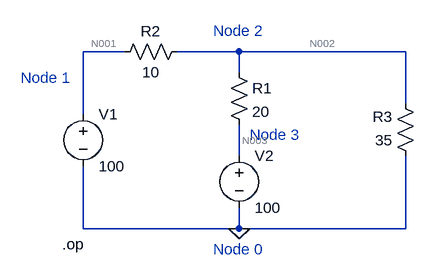
[diagram p0: schematic picture_1.1_schematic.asc]
picture_1.1_schematic.asc, the LTspice schematic file:
Version 4.1
SHEET 1 880 680
WIRE 48 48 -16 48
WIRE 224 48 128 48
WIRE 480 48 224 48
WIRE 224 80 224 48
WIRE 480 128 480 48
WIRE -16 144 -16 48
WIRE 224 208 224 160
WIRE -16 320 -16 224
WIRE 224 320 224 288
WIRE 224 320 -16 320
WIRE 480 320 480 208
WIRE 480 320 224 320
FLAG 224 320 0
DATAFLAG -16 48 ""
DATAFLAG 304 48 ""
DATAFLAG 176 320 ""
DATAFLAG 224 176 ""
SYMBOL voltage -16 128 R0
WINDOW 123 0 0 Left 0
WINDOW 39 0 0 Left 0
SYMATTR InstName V1
SYMATTR Value 100
SYMBOL voltage 224 192 R0
WINDOW 123 0 0 Left 0
WINDOW 39 0 0 Left 0
SYMATTR InstName V2
SYMATTR Value 100
SYMBOL res 208 64 R0
SYMATTR InstName R1
SYMATTR Value 20
SYMBOL res 144 32 R90
WINDOW 0 0 56 VBottom 2
WINDOW 3 32 56 VTop 2
SYMATTR InstName R2
SYMATTR Value 10
SYMBOL res 496 224 R180
WINDOW 0 36 76 Left 2
WINDOW 3 36 40 Left 2
SYMATTR InstName R3
SYMATTR Value 35
TEXT -48 344 Left 2 !.op
TEXT -112 88 Left 2 ;Node 1
TEXT 184 16 Left 2 ;Node 2
TEXT 240 176 Left 2 ;Node 3
TEXT 184 352 Left 2 ;Node 0

The netlist it stands for:
* picture_1.1_schematic.asc
V1 N001 0 100
V2 N003 0 100
R1 N002 N003 20
R2 N002 N001 10
R3 0 N002 35
.op
* Node 1
* Node 2
* Node 3
* Node 0
.backanno
.end

* Results of the author's LTspice run, read from the files saved beside the schematic
* Operating Point:
*   V(n001) = 100 V
*   V(n002) = 84 V
*   V(n003) = 100 V
*   I(R1) = -800 mA
*   I(R2) = -1.6 A
*   I(R3) = -2.4 A
*   I(V1) = -1.6 A
*   I(V2) = -800 mA